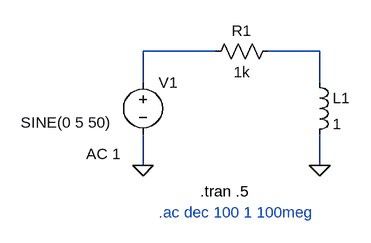
[diagram p0: schematic RL.asc]
RL.asc, the LTspice schematic file:
Version 4.1
SHEET 1 880 680
WIRE 160 64 48 64
WIRE 320 64 240 64
WIRE 48 112 48 64
WIRE 320 112 320 64
WIRE 48 240 48 192
WIRE 320 240 320 192
FLAG 48 240 0
FLAG 320 240 0
SYMBOL voltage 48 96 R0
WINDOW 3 -188 78 Left 2
WINDOW 123 -87 126 Left 2
WINDOW 39 0 0 Left 0
SYMATTR Value SINE(0 5 50)
SYMATTR Value2 AC 1
SYMATTR InstName V1
SYMBOL res 256 48 R90
WINDOW 0 0 56 VBottom 2
WINDOW 3 32 56 VTop 2
SYMATTR InstName R1
SYMATTR Value 1k
SYMBOL ind 304 96 R0
SYMATTR InstName L1
SYMATTR Value 1
TEXT 136 280 Left 2 !.tran .5
TEXT 72 312 Left 2 ;.ac dec 100 1 100meg

The netlist it stands for:
* RL.asc
V1 N001 0 SINE(0 5 50) AC 1
R1 N002 N001 1k
L1 N002 0 1
.tran .5
* .ac dec 100 1 100meg
.backanno
.end